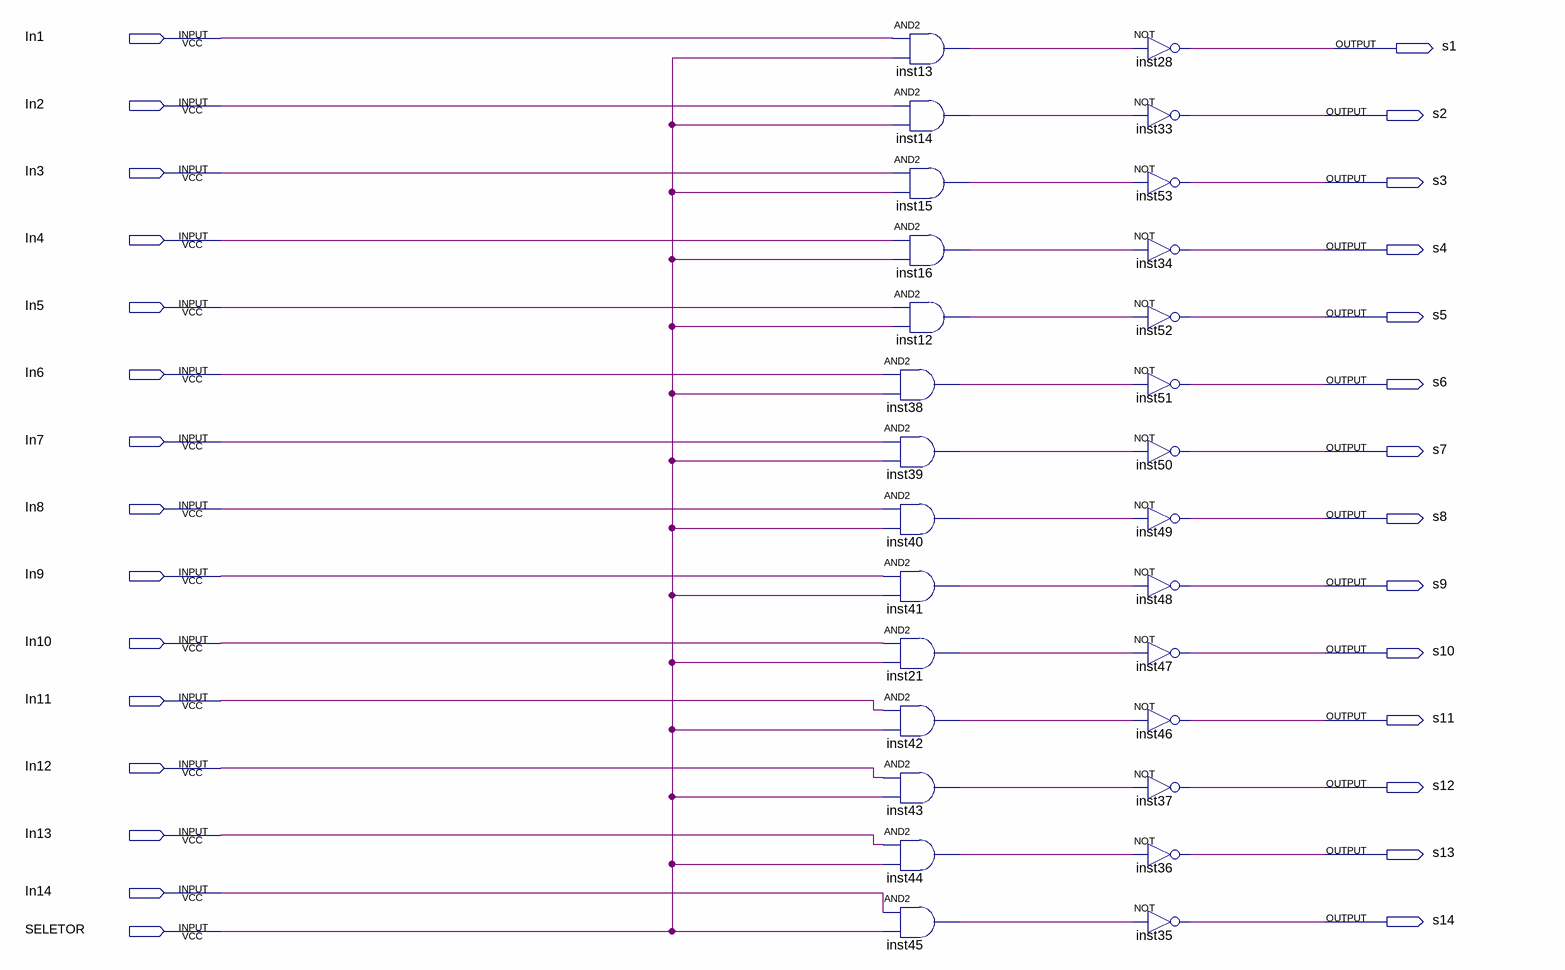
[diagram p0: schematic sheet]
// Quartus schematic selectDisplay.bdf as structural Verilog: 28 symbols, 29 pins
module selectDisplay (
  input  In1,
  input  In2,
  input  In3,
  input  In4,
  input  In5,
  input  In6,
  input  In7,
  input  In8,
  input  In9,
  input  In10,
  input  In11,
  input  In12,
  input  In13,
  input  In14,
  input  SELETOR,
  output s1,
  output s2,
  output s3,
  output s4,
  output s5,
  output s6,
  output s7,
  output s8,
  output s9,
  output s10,
  output s11,
  output s12,
  output s13,
  output s14
);

  wire inst12_out, inst13_out, inst14_out, inst15_out, inst16_out, inst21_out, inst38_out, inst39_out,
       inst40_out, inst41_out, inst42_out, inst43_out, inst44_out, inst45_out;

  and inst13 (inst13_out, In1, SELETOR);
  and inst14 (inst14_out, In2, SELETOR);
  and inst15 (inst15_out, In3, SELETOR);
  and inst16 (inst16_out, In4, SELETOR);
  and inst12 (inst12_out, In5, SELETOR);
  and inst38 (inst38_out, In6, SELETOR);
  and inst39 (inst39_out, In7, SELETOR);
  and inst40 (inst40_out, In8, SELETOR);
  and inst41 (inst41_out, In9, SELETOR);
  and inst21 (inst21_out, In10, SELETOR);
  and inst42 (inst42_out, In11, SELETOR);
  and inst43 (inst43_out, In12, SELETOR);
  and inst44 (inst44_out, In13, SELETOR);
  and inst45 (inst45_out, In14, SELETOR);
  not inst28 (s1, inst13_out);
  not inst33 (s2, inst14_out);
  not inst53 (s3, inst15_out);
  not inst34 (s4, inst16_out);
  not inst52 (s5, inst12_out);
  not inst51 (s6, inst38_out);
  not inst50 (s7, inst39_out);
  not inst49 (s8, inst40_out);
  not inst48 (s9, inst41_out);
  not inst47 (s10, inst21_out);
  not inst46 (s11, inst42_out);
  not inst37 (s12, inst43_out);
  not inst36 (s13, inst44_out);
  not inst35 (s14, inst45_out);
endmodule
